# Altium schematic sheet 3mat.SchDoc
size A4; SheetNumber: 1; SheetTotal: 1
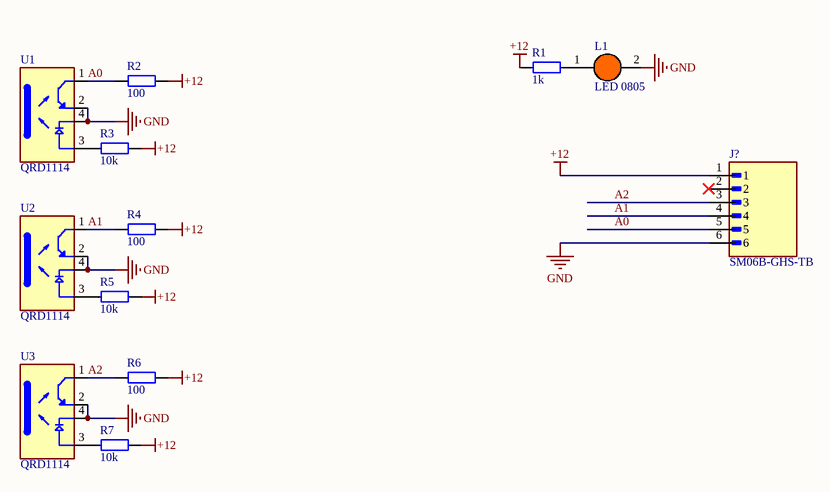
[diagram p0: 3mat.SchDoc]

## Parts
J?  SM06B-GHS-TB  [JST_SM06B-GHS-TB]
L1  LED 0805  [LED-0805-Orange]
R1  1k  [SM-0805]
R2  100  [SM-0805]
R3  10k  [SM-0805]
R4  100  [SM-0805]
R5  10k  [SM-0805]
R6  100  [SM-0805]
R7  10k  [SM-0805]
U1  QRD1114  [ONS_QRD1114]
U2  QRD1114  [ONS_QRD1114]
U3  QRD1114  [ONS_QRD1114]

## Nets
+12: J?.1 R1.1 R2.2 R3.2 R4.2 R5.2 R6.2 R7.2
GND: J?.6 L1.2(K) U1.2(ET) U1.4(C) U2.2(ET) U2.4(C) U3.2(ET) U3.4(C)
A0: J?.5 R2.1 U1.1(CT)
A1: J?.4 R4.1 U2.1(CT)
A2: J?.3 R6.1 U3.1(CT)
NetL1_1: L1.1(A) R1.2
NetR3_1: R3.1 U1.3(A)
NetR5_1: R5.1 U2.3(A)
NetR7_1: R7.1 U3.3(A)

Not connected (* = marked no-connect by the designer): J? 2*

## Library data of the parts
J? = SM06B-GHS-TB: Connector Header Surface Mount, Right Angle 6 position 0.049 (1.25mm); MF: JST Sales; SnapEDA_Link: https://www.snapeda.com/parts/SM06B-GHS-TB/JST/view-part/?ref=snap; Package: None; Value: *; MP: SM06B-GHS-TB; Check_prices: https://www.snapeda.com/parts/SM06B-GHS-TB/JST/view-part/?ref=eda
L1 = LED 0805 Cam: Dán; Don_Vi: Con; Ma_Hang: MH002328; Ten_Linh_Kien: LED 0805 Màu Cam ( Orange); Ghi_Chu: *; Kieu_Chan: *; Chung_Loai: Dán
R1 = RM: Resistor SMD; Value: 1K
R2-R7 = RM: Resistor SMD; Value: 1K
U1-U3 = QRD1114: Reflective Optical Sensor 0.050 (1.27mm) Radial - 4 Leads; MF: onsemi; SnapEDA_Link: https://www.snapeda.com/parts/QRD1114/Onsemi/view-part/?ref=snap; Package: NON-STANDARD-4 ON Semiconductor; Value: *; MP: QRD1114; Check_prices: https://www.snapeda.com/parts/QRD1114/Onsemi/view-part/?ref=eda